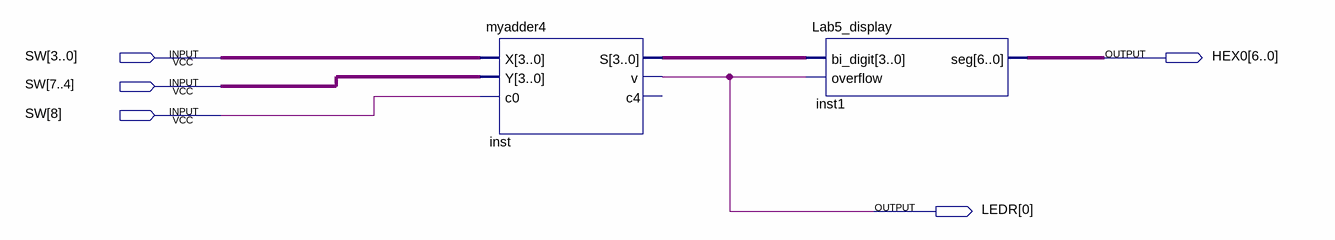
[diagram p0: schematic sheet]
// Quartus schematic lab5.bdf as structural Verilog: 2 symbols, 5 pins
module lab5 (
  input  [8:0] SW,
  output [6:0] HEX0,
  output [0:0] LEDR
);

  wire [3:0] inst_s;

  myadder4 inst (.X(SW[3:0]), .Y(SW[7:4]), .c0(SW[8]), .S(inst_s), .v(LEDR[0]));  // open: c4
  Lab5_display inst1 (.bi_digit(inst_s), .overflow(LEDR[0]), .seg(HEX0));
endmodule
